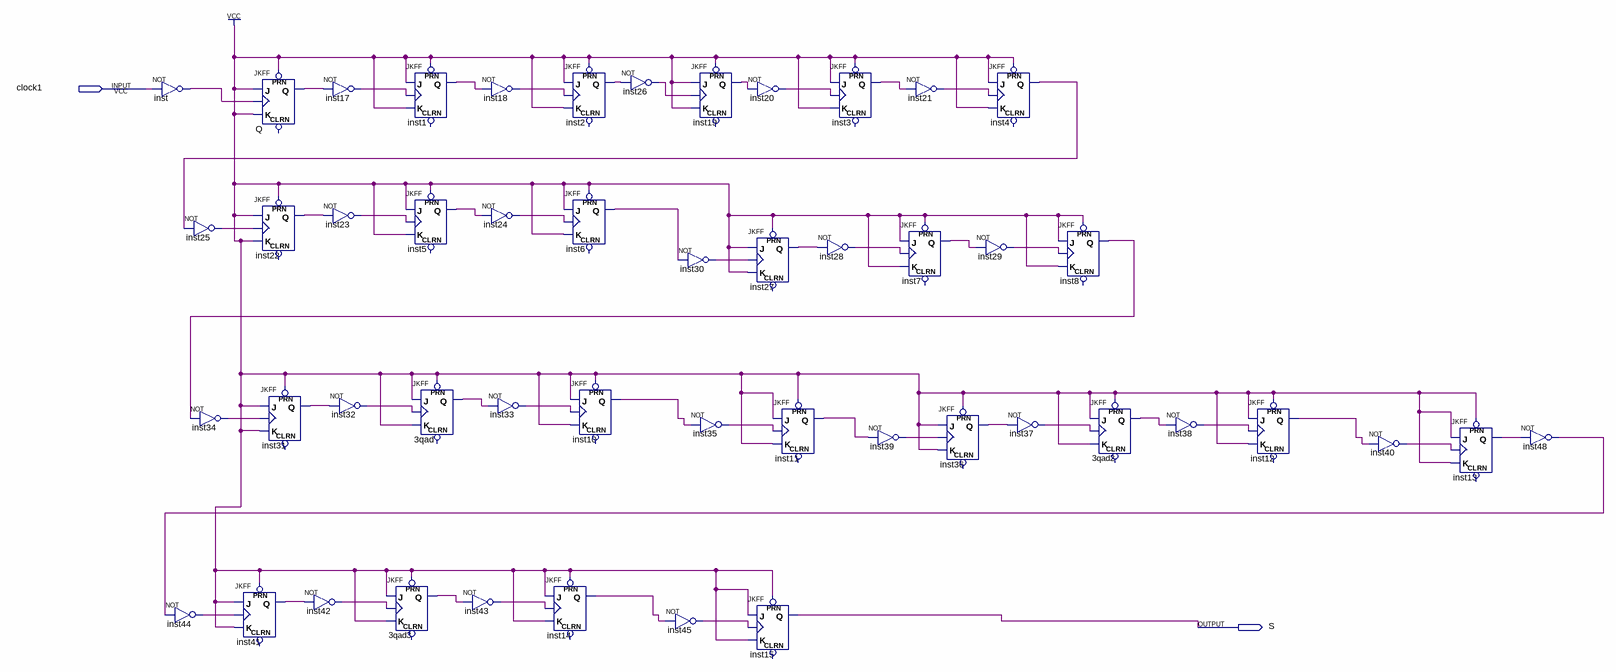
[diagram p0: schematic sheet]
// Quartus schematic divisor05.bdf as structural Verilog: 49 symbols, 2 pins
module divisor05 (
  input  clock1,
  output S
);

  wire inst1_q, inst2_q, inst3_q, inst4_q, inst5_q, inst6_q, inst7_q, inst8_q, inst10_q, inst11_q, inst12_q,
       inst13_q, inst14_q, inst17_out, inst18_out, inst19_q, inst20_out, inst21_out, inst22_q, inst23_out,
       inst24_out, inst25_out, inst26_out, inst27_q, inst28_out, inst29_out, inst30_out, inst31_q,
       inst32_out, inst33_out, inst34_out, inst35_out, inst36_q, inst37_out, inst38_out, inst39_out,
       inst40_out, inst41_q, inst42_out, inst43_out, inst44_out, inst45_out, inst48_out, inst_out, n3qad2_q,
       n3qad3_q, n3qad_q, Q_q;

  not inst (inst_out, clock1);
  not inst25 (inst25_out, inst4_q);
  not inst34 (inst34_out, inst8_q);
  not inst44 (inst44_out, inst48_out);
  JKFF inst41 (.PRN(1'b1), .K(1'b1), .J(1'b1), .CLK(inst44_out), .Q(inst41_q));  // open: CLRN
  JKFF Q (.PRN(1'b1), .K(1'b1), .J(1'b1), .CLK(inst_out), .Q(Q_q));  // open: CLRN
  JKFF inst22 (.PRN(1'b1), .K(1'b1), .J(1'b1), .CLK(inst25_out), .Q(inst22_q));  // open: CLRN
  JKFF inst31 (.PRN(1'b1), .K(1'b1), .J(1'b1), .CLK(inst34_out), .Q(inst31_q));  // open: CLRN
  not inst17 (inst17_out, Q_q);
  not inst23 (inst23_out, inst22_q);
  not inst32 (inst32_out, inst31_q);
  not inst42 (inst42_out, inst41_q);
  JKFF u_3qad3 (.PRN(1'b1), .K(1'b1), .J(1'b1), .CLK(inst42_out), .Q(n3qad3_q));  // open: CLRN
  JKFF inst1 (.PRN(1'b1), .K(1'b1), .J(1'b1), .CLK(inst17_out), .Q(inst1_q));  // open: CLRN
  JKFF inst5 (.PRN(1'b1), .K(1'b1), .J(1'b1), .CLK(inst23_out), .Q(inst5_q));  // open: CLRN
  JKFF u_3qad (.PRN(1'b1), .K(1'b1), .J(1'b1), .CLK(inst32_out), .Q(n3qad_q));  // open: CLRN
  not inst18 (inst18_out, inst1_q);
  not inst24 (inst24_out, inst5_q);
  not inst33 (inst33_out, n3qad_q);
  not inst43 (inst43_out, n3qad3_q);
  JKFF inst14 (.PRN(1'b1), .K(1'b1), .J(1'b1), .CLK(inst43_out), .Q(inst14_q));  // open: CLRN
  JKFF inst2 (.PRN(1'b1), .K(1'b1), .J(1'b1), .CLK(inst18_out), .Q(inst2_q));  // open: CLRN
  JKFF inst6 (.PRN(1'b1), .K(1'b1), .J(1'b1), .CLK(inst24_out), .Q(inst6_q));  // open: CLRN
  JKFF inst10 (.PRN(1'b1), .K(1'b1), .J(1'b1), .CLK(inst33_out), .Q(inst10_q));  // open: CLRN
  not inst26 (inst26_out, inst2_q);
  JKFF inst19 (.PRN(1'b1), .K(1'b1), .J(1'b1), .CLK(inst26_out), .Q(inst19_q));  // open: CLRN
  not inst30 (inst30_out, inst6_q);
  not inst35 (inst35_out, inst10_q);
  not inst45 (inst45_out, inst14_q);
  not inst20 (inst20_out, inst19_q);
  JKFF inst27 (.PRN(1'b1), .K(1'b1), .J(1'b1), .CLK(inst30_out), .Q(inst27_q));  // open: CLRN
  JKFF inst15 (.PRN(1'b1), .K(1'b1), .J(1'b1), .CLK(inst45_out), .Q(S));  // open: CLRN
  JKFF inst11 (.PRN(1'b1), .K(1'b1), .J(1'b1), .CLK(inst35_out), .Q(inst11_q));  // open: CLRN
  JKFF inst3 (.PRN(1'b1), .K(1'b1), .J(1'b1), .CLK(inst20_out), .Q(inst3_q));  // open: CLRN
  not inst28 (inst28_out, inst27_q);
  not inst21 (inst21_out, inst3_q);
  JKFF inst7 (.PRN(1'b1), .K(1'b1), .J(1'b1), .CLK(inst28_out), .Q(inst7_q));  // open: CLRN
  not inst39 (inst39_out, inst11_q);
  JKFF inst36 (.PRN(1'b1), .K(1'b1), .J(1'b1), .CLK(inst39_out), .Q(inst36_q));  // open: CLRN
  JKFF inst4 (.PRN(1'b1), .K(1'b1), .J(1'b1), .CLK(inst21_out), .Q(inst4_q));  // open: CLRN
  not inst29 (inst29_out, inst7_q);
  not inst37 (inst37_out, inst36_q);
  JKFF inst8 (.PRN(1'b1), .K(1'b1), .J(1'b1), .CLK(inst29_out), .Q(inst8_q));  // open: CLRN
  JKFF u_3qad2 (.PRN(1'b1), .K(1'b1), .J(1'b1), .CLK(inst37_out), .Q(n3qad2_q));  // open: CLRN
  not inst38 (inst38_out, n3qad2_q);
  JKFF inst12 (.PRN(1'b1), .K(1'b1), .J(1'b1), .CLK(inst38_out), .Q(inst12_q));  // open: CLRN
  not inst40 (inst40_out, inst12_q);
  JKFF inst13 (.PRN(1'b1), .K(1'b1), .J(1'b1), .CLK(inst40_out), .Q(inst13_q));  // open: CLRN
  not inst48 (inst48_out, inst13_q);
endmodule
